# EAGLE design ir_single_slim (EAGLE 6.1)
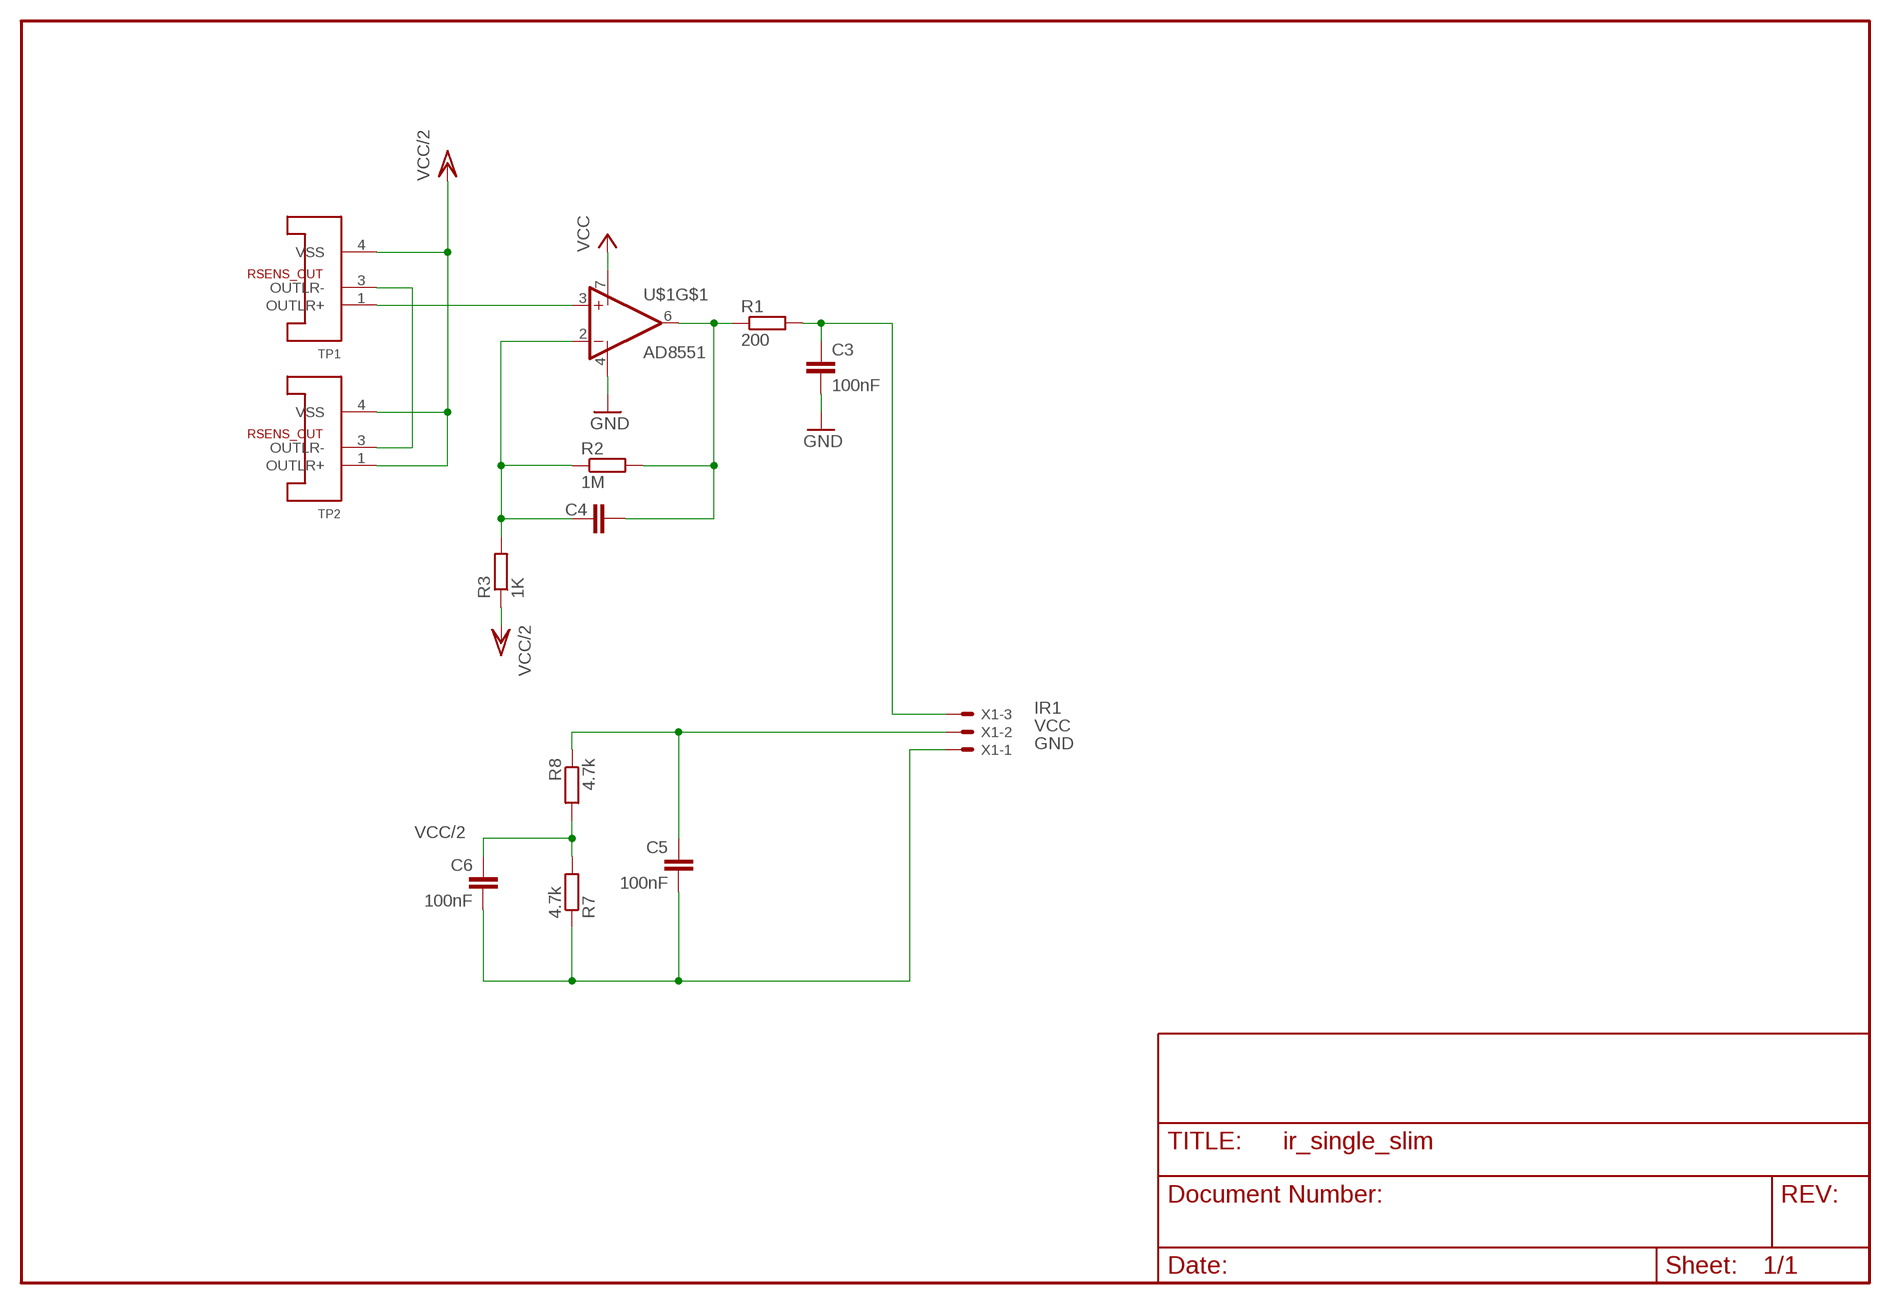
[diagram p0: schematic, sheet 1]

## Parts
C3  100nF  C-EUC0603  [C0603]
C4  C-EUC0603  [C0603]
C5  100nF  C-EUC0603  [C0603]
C6  100nF  C-EUC0603  [C0603]
R1  200  R-EU_R0603  [R0603]
R2  1M  R-EU_R0603  [R0603]
R3  1K  R-EU_R0603  [R0603]
R7  4.7k  R-EU_R0603  [R0603]
R8  4.7k  R-EU_R0603  [R0603]
TP1  MLX90247V  [TO39]
TP2  MLX90247V  [TO39]
U$1  AD8551  [MSOP8]
X1  53047-03  [53047-03]

## Nets
GND: C3.2 C5.2 C6.2 R7.1 U$1.4(V-) X1.1
IR1: C3.1 R1.2 X1.3
N$2: TP1.3(OUTLR-) TP2.3(OUTLR-)
N$8: C4.2 R1.1 R2.2 U$1.6(OUT)
N$11: TP1.1(OUTLR+) U$1.3(+IN)
N$125: C4.1 R2.1 R3.2 U$1.2(-IN)
VCC: C5.1 R8.1 U$1.7(V+) X1.2
VCC/2: C6.1 R3.1 R7.2 R8.2 TP1.4(VSS) TP2.1(OUTLR+) TP2.4(VSS)

## Library data of the parts
C3-C6 = rcl:C-EU: CAPACITOR, European symbol
R1-R3 R7 R8 = rcl:R-EU_: RESISTOR, European symbol
TP1 TP2 = paparazzi:MLX90247: Thermopile sensor
U$1 = paparazzi:AD8551: single op amp
X1 = con-molex:53?-03: CONNECTOR wire to board 1.25 mm (.049 inch) pitch header

## Board
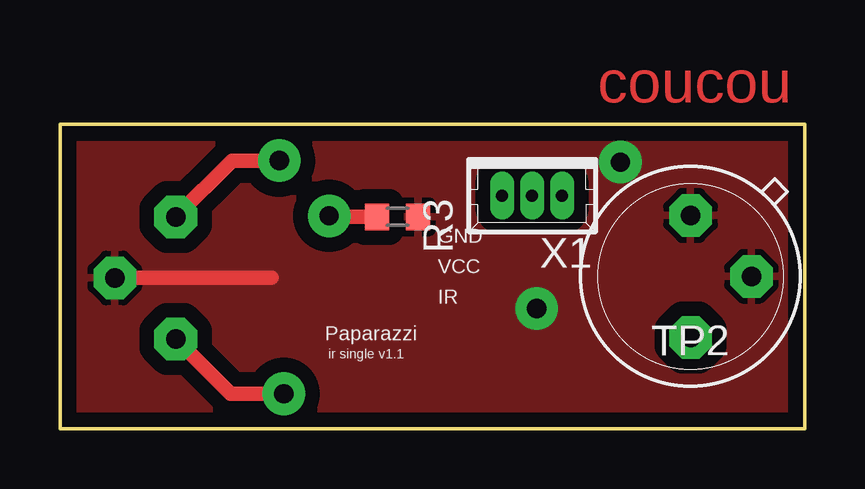
[diagram p1: board, top side]
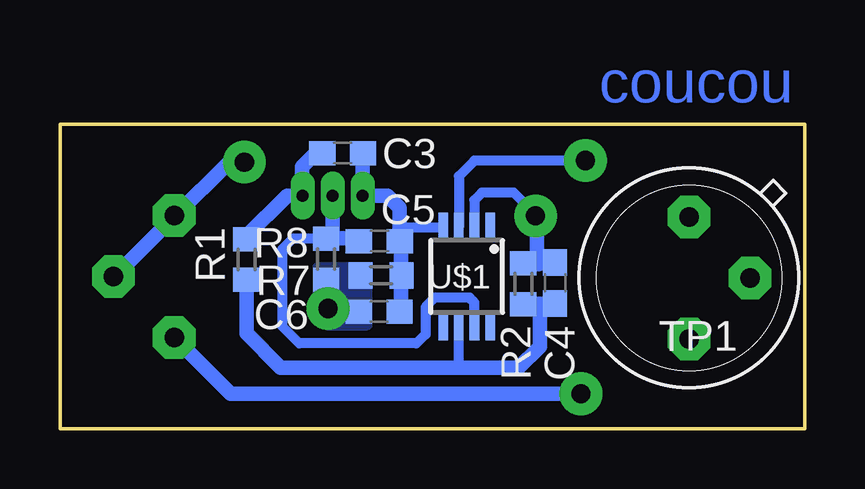
[diagram p2: board, bottom side, seen from below]

Size 31.05 x 12.7 mm. Coordinates in mm from the lower left corner, seen from the top.
Outline: 31.05,0 31.05,12.7 0,12.7 0,0 31.05,0
Copper layers (1*16): Top 0.035mm / dielectric 1.5mm / Bottom 0.035mm
Design rules: minimum track width 6mil, minimum drill 12mil, track to track 6mil, track to pad 6mil, pad to pad 6mil, via to via 6mil, smd to smd 6mil, copper to edge 10mil, drill to drill 8mil, minimum pad ring 10mil, minimum via ring 8mil, stop-mask expansion 4mil, vias tented up to drill 0mil, thermal gap 10mil

### Footprints (pad centres in the part's own frame; a part is rotated, then mirrored left to right if it is on the bottom)
C0603 = smd 1.1 x 1: 1 -0.85,0; 2 0.85,0
R0603 = smd 1 x 1.1: 1 -0.85,0; 2 0.85,0
TO39 = drill 0.813 pad 1.778 octagon: 1 0,-2.54; 3 0,2.54; 4 -2.54,0
MSOP8 = smd 0.4 x 1.2: 1 -0.975,-2.05; 2 -0.325,-2.05; 3 0.325,-2.05; 4 0.975,-2.05; 5 0.975,2.05; 6 0.325,2.05; 7 -0.325,2.05; 8 -0.975,2.05
53047-03 = drill 0.5 pad 0.698 long: 1 1.25,0; 2 0,0; 3 -1.25,0

### Placement (x,y rotation side)
C3  19.27,11.48 0 bottom
C4  10.42,6.08 270 bottom
C5  17.74,7.81 0 bottom
C6  17.74,4.88 0 bottom
R1  23.28,7.06 90 bottom
R2  11.74,6.04 270 bottom
R3  14.07,8.83 180 top
R7  17.67,6.39 180 bottom
R8  19.96,7.07 270 bottom
TP1  4.83,6.29 180 bottom
TP2  26.29,6.35 180 top
U$1  14.1,6.35 180 bottom
X1  19.69,9.72 180 top

### Tracks (layer width: path | path; a pad name or v marks a point on that pad's centre or on a via)
GND
  Bottom 0.305: C5.2 16.89,7.94
  Bottom 0.406: C5.2 16.89,8.38 16.87,8.4 U$1.4
  Bottom 0.61: 16.83,6.66 16.83,6.67 | C6.2 16.83,5.39 16.83,6.66 | 16.83,6.66 R7.1 | 16.83,6.66 16.83,7.94 16.89,7.94 C5.2 16.89,9.2 17.4,9.72 X1.1 18.44,11.47 18.42,11.49 | 18.42,11.49 18.41,11.49 | 18.42,11.49 C3.2
IR1
  Bottom 0.254: 19.69,11.49 19.7,11.48 C3.1
  Bottom 0.61: R1.2 23.28,7.97 23.3,8 21.59,9.72 X1.3 20.94,9.67 20.96,9.65 20.96,10.92 20.4,11.48 C3.1
N$2  (via drill 0.8 pad 1.78)
  Top 0.61: v9.33,1.46 7.11,1.46 TP1.3
  Bottom 0.61: TP2.3 23.94,1.46 v9.33,1.46
N$8
  Bottom 0.406: U$1.6 14.42,2.55 14.41,2.54
  Bottom 0.61: 11.05,5.21 11.05,3.43 11.94,2.54 14.41,2.54 21.84,2.54 23.28,3.97 R1.1 | C4.2 10.42,5.21 10.41,5.21 11.05,5.21 | R2.2 11.7,5.19 11.68,5.21 11.05,5.21
N$11  (via drill 0.8 pad 1.78)
  Top 0.61: TP1.1 7.17,11.18 v9.14,11.18
  Bottom 0.406: U$1.3 14.42,10.53 13.78,11.18 v9.14,11.18
N$125  (via drill 0.8 pad 1.78)
  Top 0.61: 11.11,8.83 11.16,8.87 v11.22,8.87 | 11.11,8.83 R3.2 | 11.11,8.83
  Bottom 0.254: C4.1 10.53,6.93 10.54,6.92 10.53,6.91
  Bottom 0.406: U$1.2 13.77,9.53 13.46,9.84 12.13,9.84 11.18,8.89 11.19,8.87 v11.22,8.87
  Bottom 0.61: 10.47,6.93 10.41,6.99 | 11.11,6.89 10.44,6.89 C4.1 10.47,6.93 | 11.11,6.89 R2.1 | 10.47,6.93 10.48,6.92 | 11.11,6.89 11.11,6.86 11.18,6.92 11.18,8.89
VCC
  Bottom 0.254: C5.1 18.59,7.94 | 19.94,7.94 R8.1 19.94,7.94
  Bottom 0.406: 19.94,7.94 21.34,7.94 21.78,7.49 21.78,4.25 21.08,3.56 16.19,3.56 15.81,3.94 15.81,5.08 15.43,5.46 13.97,5.46 13.77,5.26 U$1.7
  Bottom 0.61: X1.2 19.69,7.94 19.94,7.94 | 19.94,7.94 19.96,7.94 R8.1 | C5.1 18.59,7.94 19.94,7.94
VCC/2  (via drill 0.8 pad 1.78)
  Top 0.61: 8.83,6.29 TP1.4
  Bottom 0.406: R7.2 18.56,6.65 18.61,6.6 18.6,6.59
  Bottom 0.61: 28.89,6.29 TP2.4 28.77,6.35 26.29,8.83 | 26.29,8.83 26.16,8.95 | TP2.1 26.29,8.83 | v23.37,11.11 24,11.11 26.29,8.83
  other vias: 19.88,5.02
  pour Top (isolate 0.61): -0.06,12.89 31.24,12.89 31.24,-0.32 -0.06,-0.32
  pour Bottom (no thermals): 18.22,6.73 20.32,6.73 20.32,4.7 19.94,4.32 18.22,4.32

### Text on the board
Top: coucou
Bottom: coucou
tNames: GND | VCC | IR | Paparazzi | ir single v1.1